# Altium schematic sheet Input_PC.SchDoc
size 420 x 297 mm
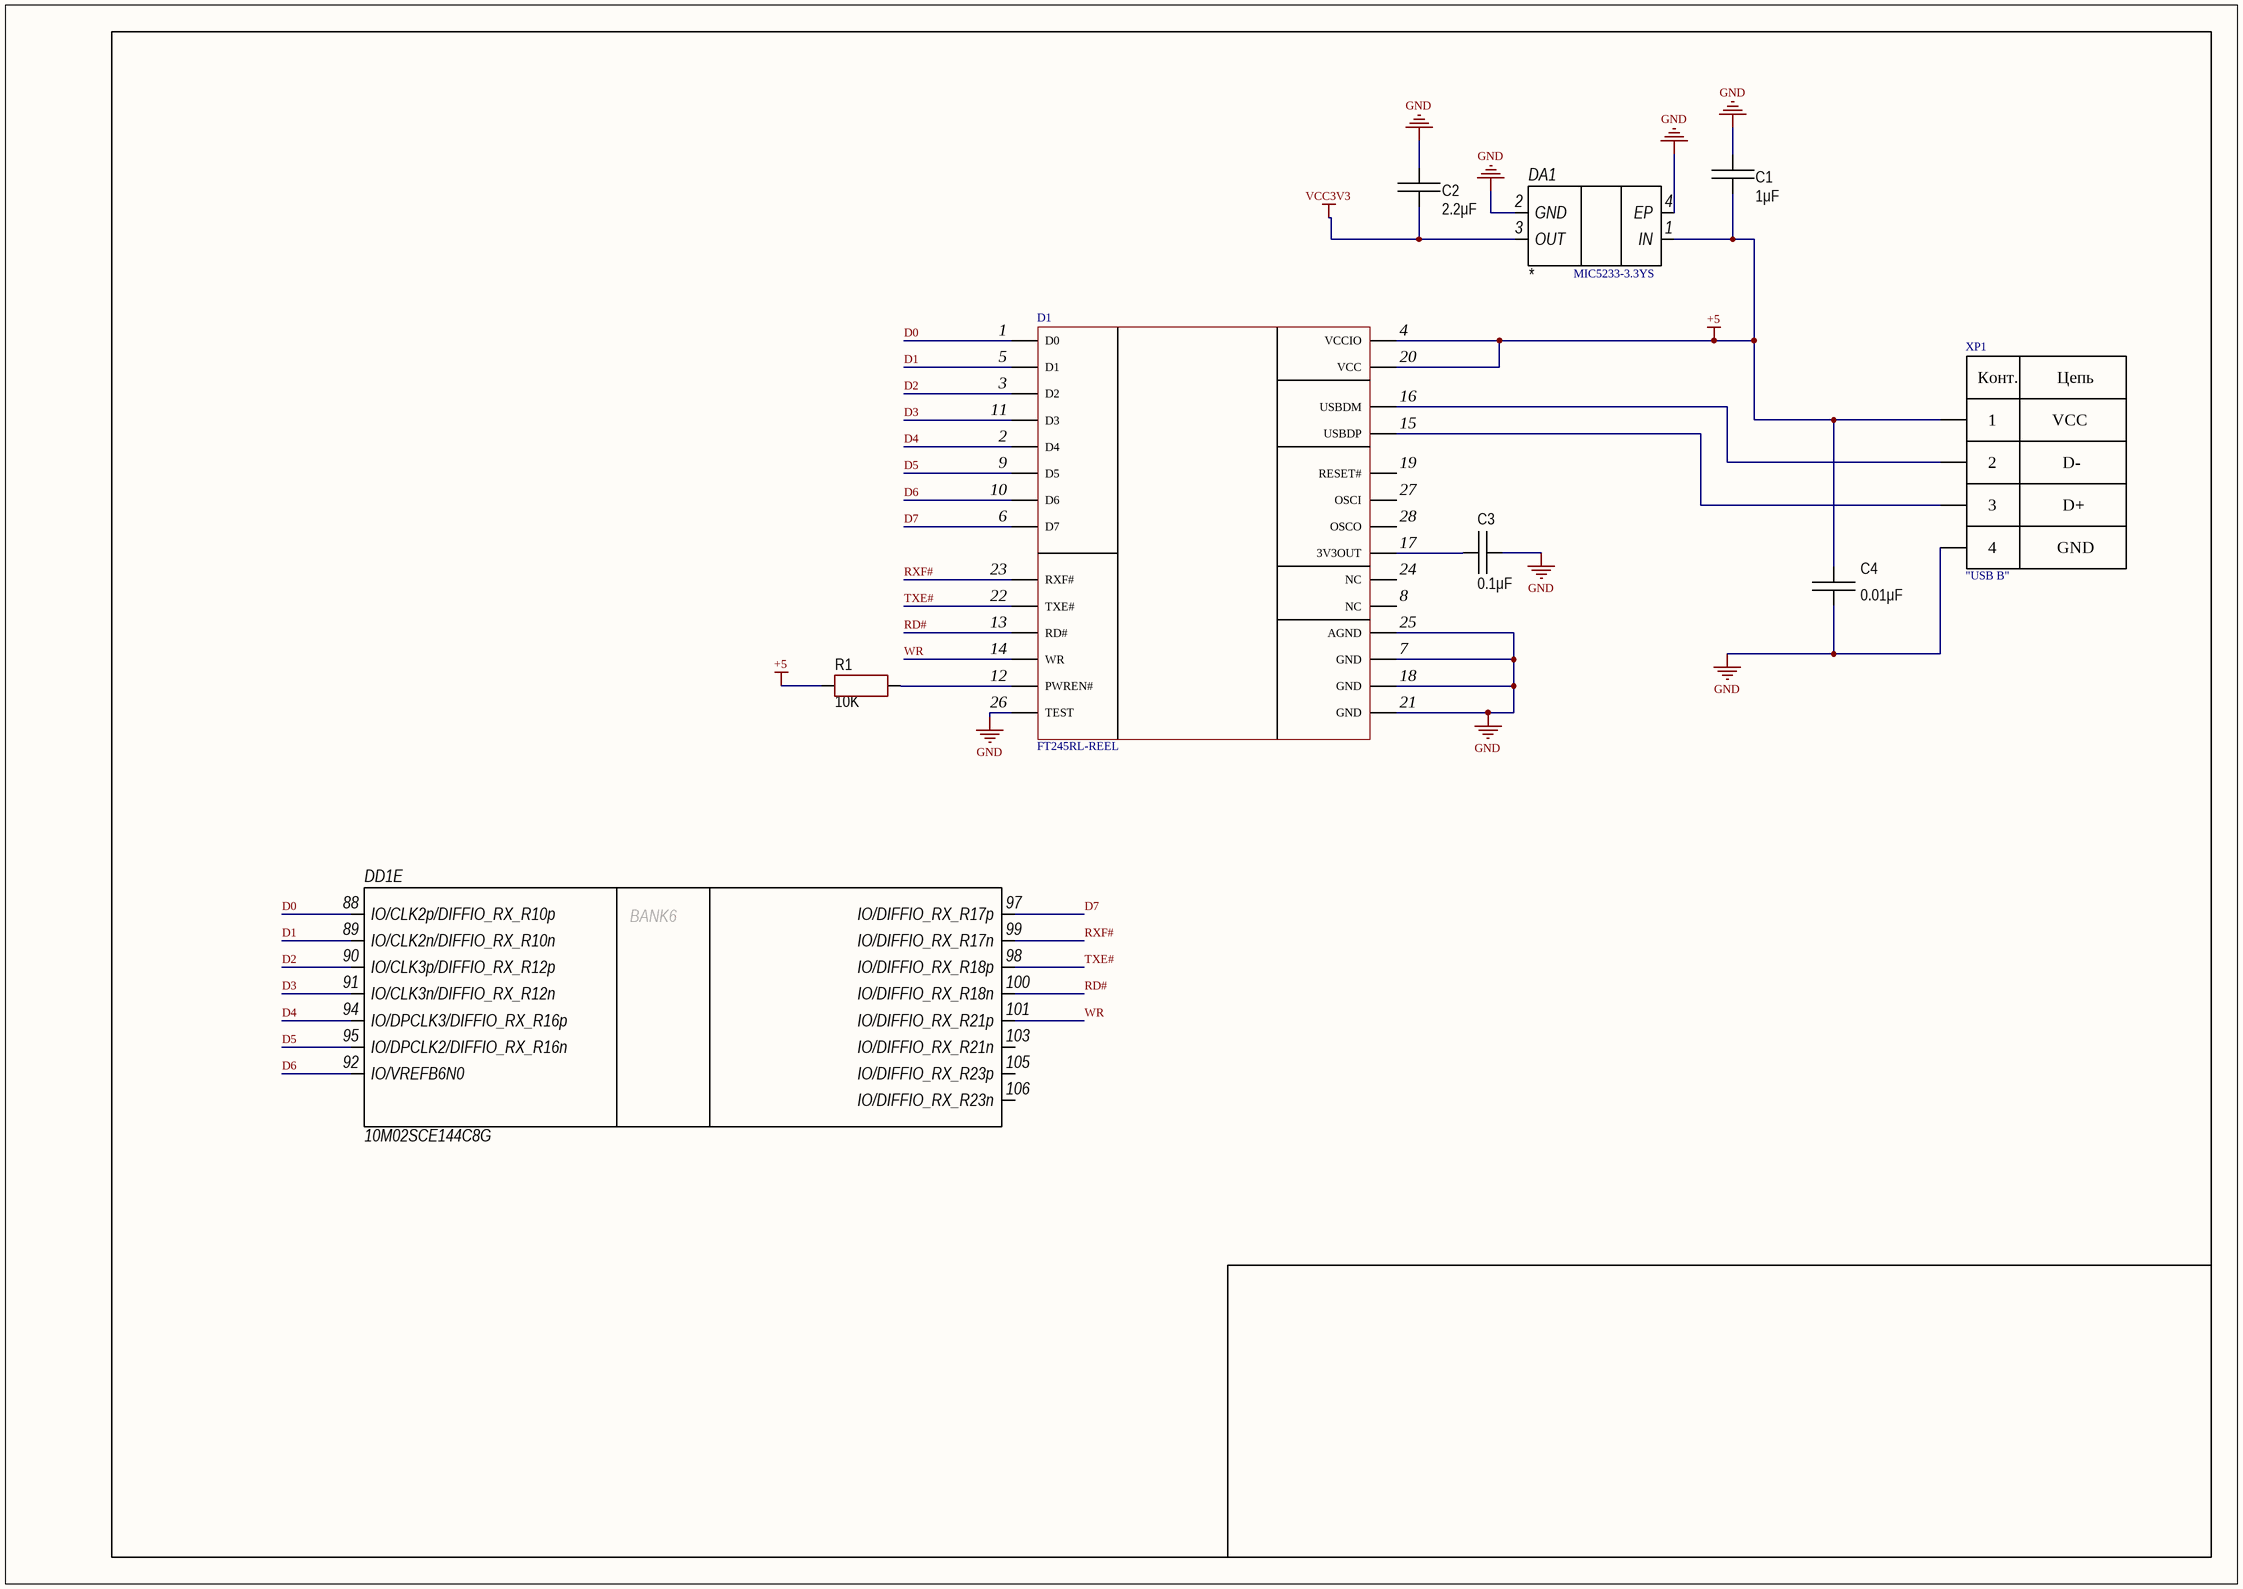
[diagram p0: Input_PC.SchDoc]

## Parts
C1  value 1μF  [CAP: 0805]
C2  value 2.2μF  [CAP: 0805]
C3  value 0.1μF  [CAP: 0805]
C4  value 0.01μF  [CAP: 0201]
D1  FT245RL-REEL  [28-SSOP]
DA1  *  PartNumber: MIC5233-3.3YS  [sot223]
DD1  10M02SCE144C8G  [144-Lead EQFP]  (part E of 7)
R1  value 10K  [RES: 0805]
XP1  "USB B"  [USB B]

## Nets
+5: C1.2 C4.2 D1.4(VCCIO) D1.20(VCC) DA1.1(IN) R1.1 XP1.1
GND: C1.1 C2.2 C3.2 C4.1 D1.7(GND) D1.18(GND) D1.21(GND) D1.25(AGND) D1.26(TEST) DA1.2(GND) DA1.4(EP) XP1.4
VCC3V3: C2.1 DA1.3(OUT)
D0: D1.1(D0) DD1.88(IO/CLK2p/DIFFIO_RX_R10p)
D1: D1.5(D1) DD1.89(IO/CLK2n/DIFFIO_RX_R10n)
D2: D1.3(D2) DD1.90(IO/CLK3p/DIFFIO_RX_R12p)
D3: D1.11(D3) DD1.91(IO/CLK3n/DIFFIO_RX_R12n)
D4: D1.2(D4) DD1.94(IO/DPCLK3/DIFFIO_RX_R16p)
D5: D1.9(D5) DD1.95(IO/DPCLK2/DIFFIO_RX_R16n)
D6: D1.10(D6) DD1.92(IO/VREFB6N0)
D7: D1.6(D7) DD1.97(IO/DIFFIO_RX_R17p)
RD#: D1.13(RD#) DD1.100(IO/DIFFIO_RX_R18n)
RXF#: D1.23(RXF#) DD1.99(IO/DIFFIO_RX_R17n)
TXE#: D1.22(TXE#) DD1.98(IO/DIFFIO_RX_R18p)
WR: D1.14(WR) DD1.101(IO/DIFFIO_RX_R21p)
NetC3_1: C3.1 D1.17(3V3OUT)
NetD1_12: D1.12(PWREN#) R1.2
NetD1_15: D1.15(USBDP) XP1.3
NetD1_16: D1.16(USBDM) XP1.2

Not connected (* = marked no-connect by the designer): D1 8(NC) 19(RESET#) 24(NC) 27(OSCI) 28(OSCO); DD1 103(IO/DIFFIO_RX_R21n) 105(IO/DIFFIO_RX_R23p) 106(IO/DIFFIO_RX_R23n)

## Notes on the sheet
- (in symbol 10M02SCE144C8G, part E) BANK6
- (in symbol USB B) Конт.; Цепь; VCC; D-; D+; GND

## Library data of the parts
C1 = Ceramic_0805: ValueManufacturerPartNumber: Ceramic capacitor, 1μF, X7R, , , 0805,; TypeCapacitor: Ceramic capacitor; TypeDielectric: X7R; Package: 0805
C2 = Ceramic_0805: ValueManufacturerPartNumber: Ceramic capacitor, 2.2μF, X7R, , , 0805,; TypeCapacitor: Ceramic capacitor; TypeDielectric: X7R; Package: 0805
C3 = Ceramic_0805: Manufacturer: Yageo; PartNumber: CC0805KRX7R7BB104; TypeCapacitor: Ceramic capacitor; Tolerance: ±10%; TypeDielectric: X7R; Package: 0805; HelpURL: https://www.digikey.com/product-detail/en/yageo/CC0805KRX7R7BB104/311-1142-1-ND/303052; ValueManufacturerPartNumber: =TypeCapacitor+', '+Value+', '+TypeDielectric+', '+Tolerance+', '+Voltage+', '+Package+', '+Temperature; Temperature: -55...+125°C
C4 = Ceramic_0201: Manufacturer: Yageo; PartNumber: CC0201KRX7R7BB103; ValueManufacturerPartNumber: Ceramic capacitor, 0.01μF, X7R, ±10%, 16V, 0201, -55...+125°C; TypeCapacitor: Ceramic capacitor; Tolerance: ±10%; TypeDielectric: X7R; Voltage: 16V; Package: 0201; HelpURL: https://www.digikey.com/product-detail/en/yageo/CC0201KRX7R7BB103/311-1404-1-ND/2833710; Temperature: -55...+125°C
D1 = FT245RL-REEL: IC USB TO PARALLEL FIFO 28-SSOP; Manufature: FTDI, Future Technology Devices International Ltd; Model: FT245RL-REEL; HelpURL: https://www.digikey.com/product-detail/en/ftdi-future-technology-devices-international-ltd/FT245RL-REEL/768-1011-2-ND/1836389; Case: 28-SSOP
DA1 = MIC5233: Voltage Regulator; Value: *; Case: *
DD1 = 10M02SCE144C8G: MAX10 FPGA; Manufacturer: Intel; Value: 10M02SCE144C8G; HelpUrl: https://www.digikey.com/product-detail/en/intel/10M02SCE144C8G/544-3098-ND/5284822; PartNumber: 10M02SCE144C8G
R1 = Resistor_0805: Manufacturer: Yageo; PartNumber: RC0805JR-07100RL; TypeResistor: Resistor film; Power: 0.125W; Package: 0805; HelpURL: https://www.digikey.com/product-detail/en/yageo/RC0805JR-07100RL/311-100ARCT-ND/731185; ValueManufacturerPartNumber: =TypeResistor+', '+Value+', '+Tolerance+', '+Package+', '+Power+', '+Temperature; Temperature: -55...+125°C
XP1 = USB B: Type Connector: USB type B; Manufacture: *; Part Number: *; URL: *